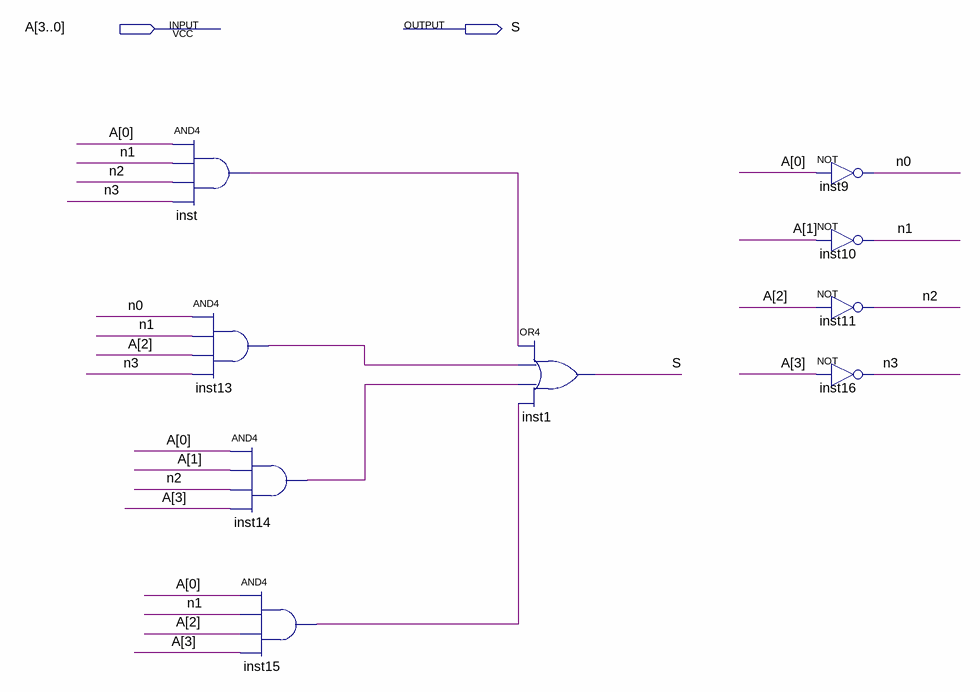
[diagram p0: schematic sheet]
// Quartus schematic SegmentoA.bdf as structural Verilog: 9 symbols, 2 pins
module SegmentoA (
  input  [3:0] A,
  output S
);

  wire inst13_out, inst14_out, inst15_out, inst_out, n0, n1, n2, n3;

  and inst (inst_out, A[0], n1, n2, n3);
  and inst13 (inst13_out, n0, n1, A[2], n3);
  and inst14 (inst14_out, A[0], A[1], n2, A[3]);
  and inst15 (inst15_out, A[0], n1, A[2], A[3]);
  or inst1 (S, inst_out, inst13_out, inst14_out, inst15_out);
  not inst9 (n0, A[0]);
  not inst10 (n1, A[1]);
  not inst11 (n2, A[2]);
  not inst16 (n3, A[3]);
endmodule
